# EasyEDA Pro project EasyEDAPro-Schematic.epro, schematic main, sheets 5 to 7 of 7

## Sheets
5 lcd-display-schematic: Create Date: 2024-01-21; Page Name: lcd-display-schematic; Update Date: 2024-01-23
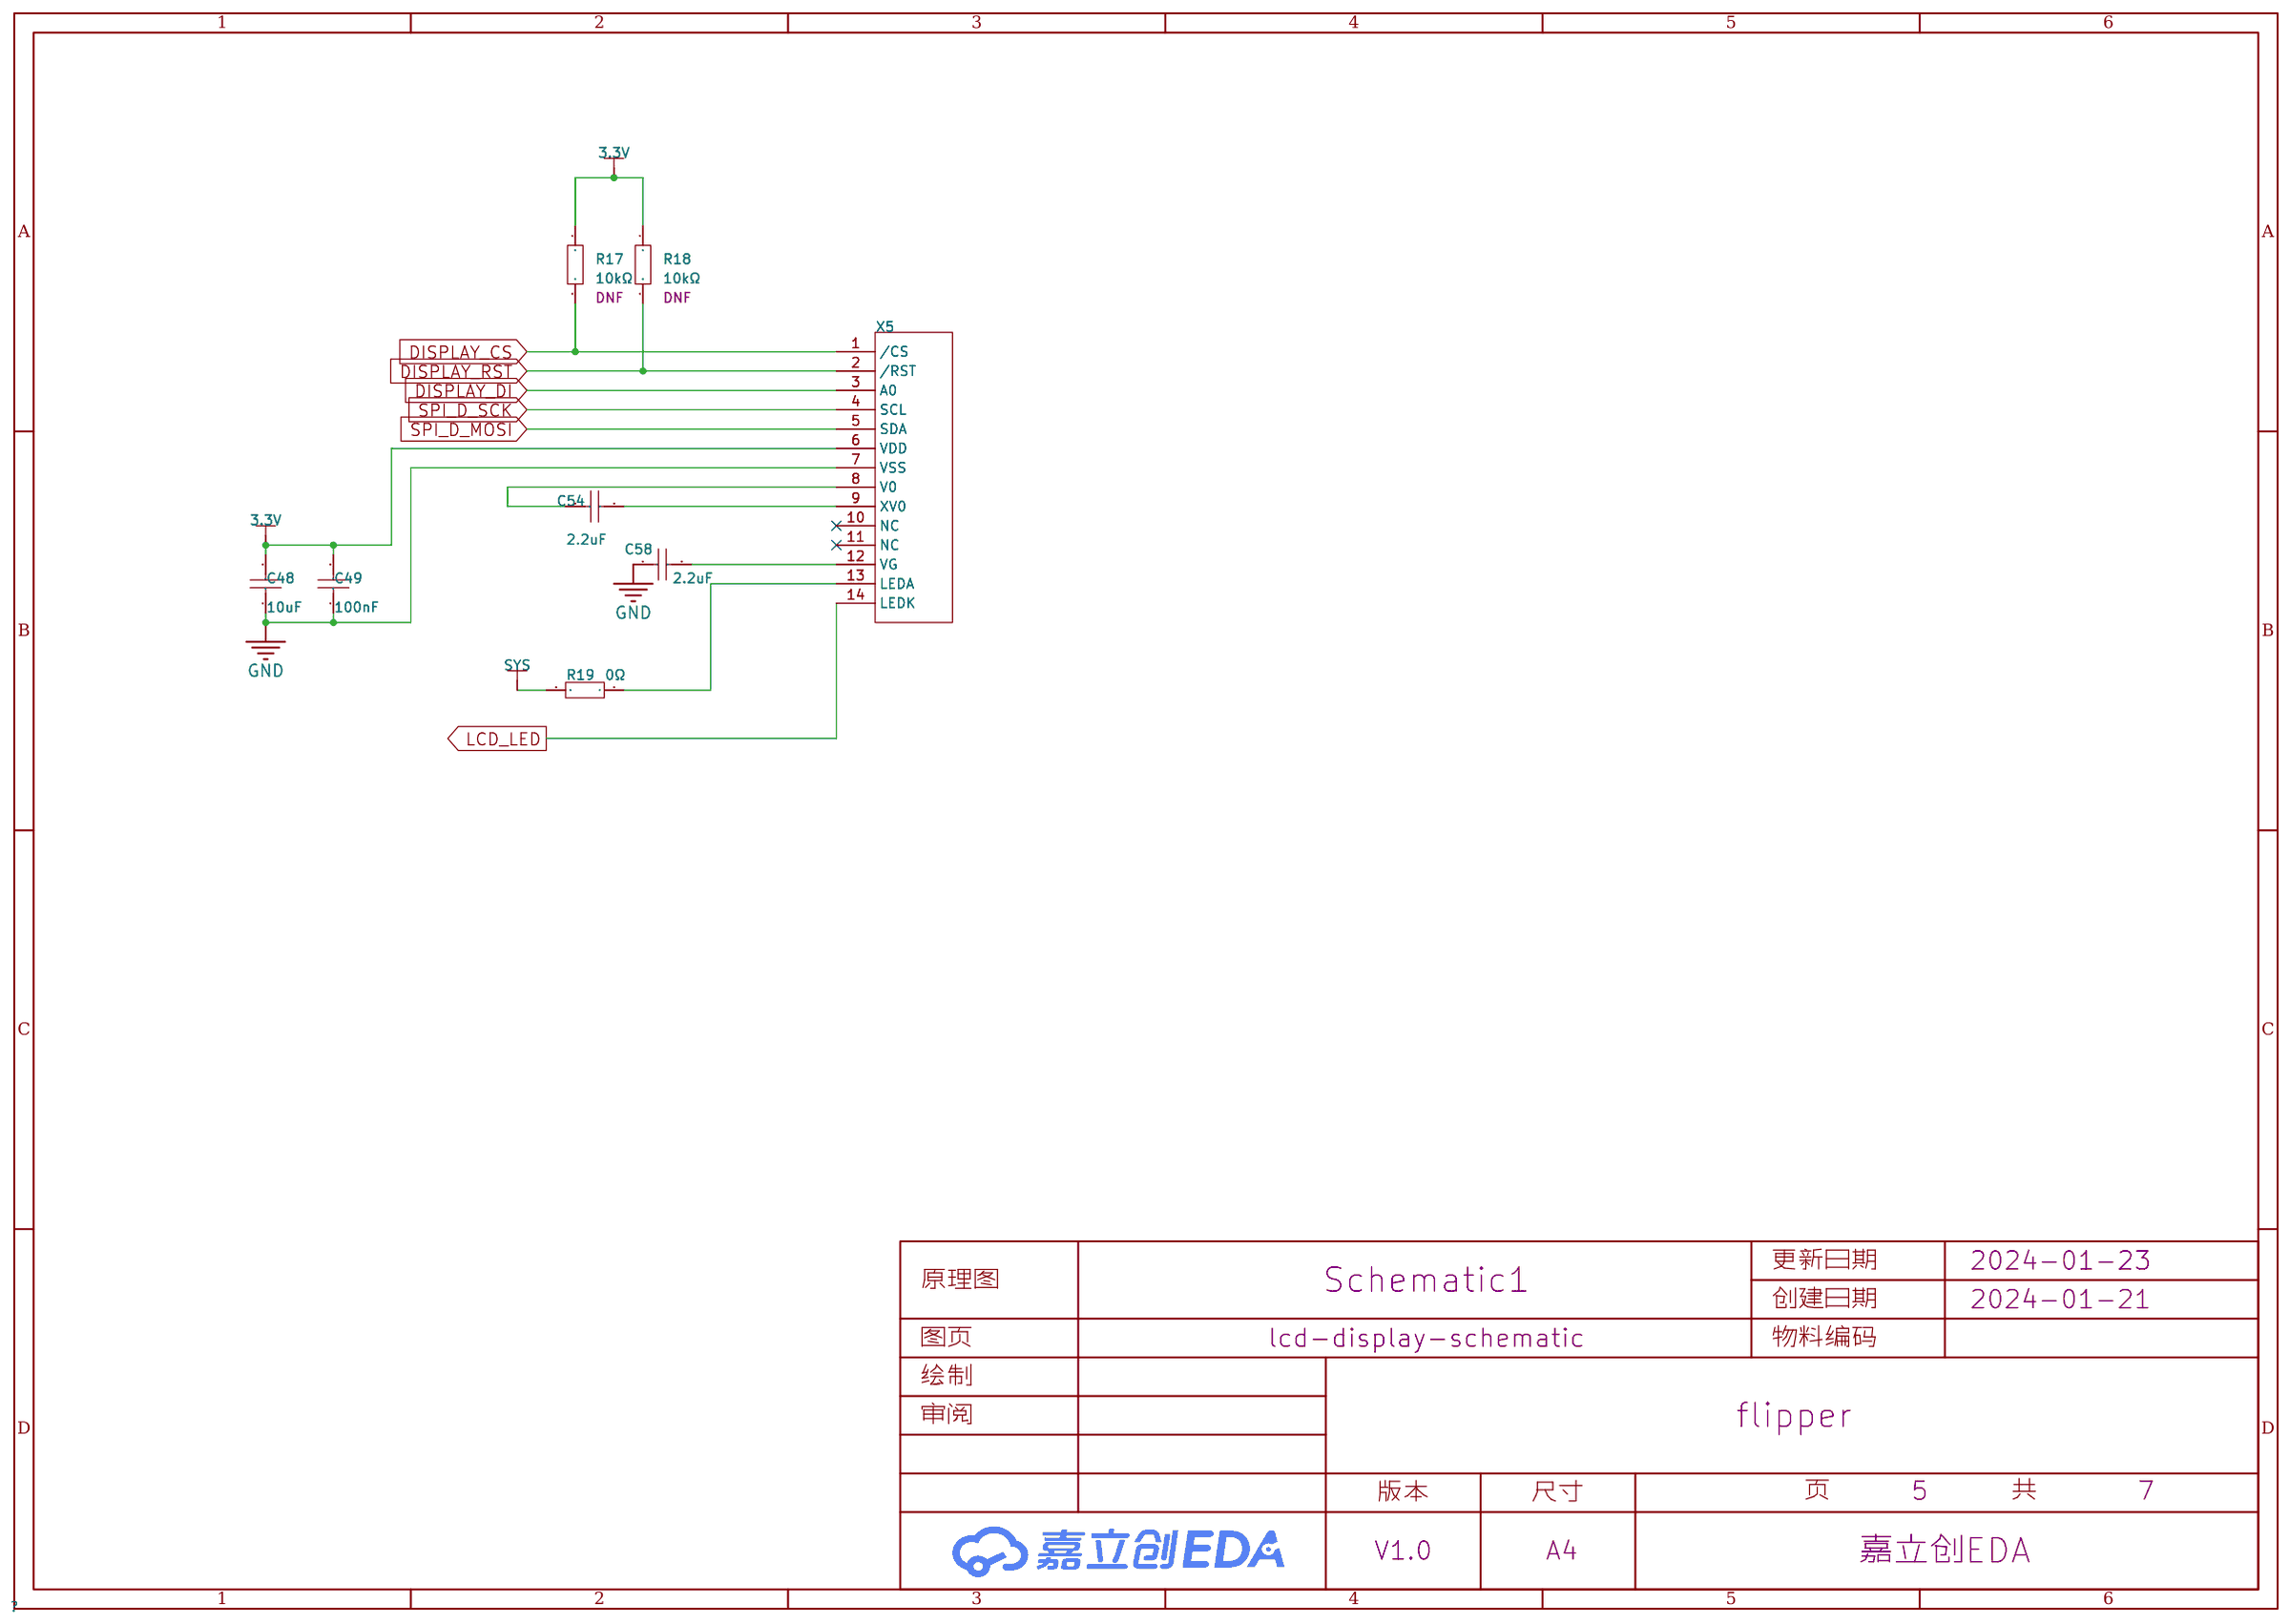
[diagram p4: lcd-display-schematic]
6 sub-1-ghz-cc1101: Create Date: 2024-01-21; Page Name: sub-1-ghz-cc1101.Schematic1; Update Date: 2024-01-23
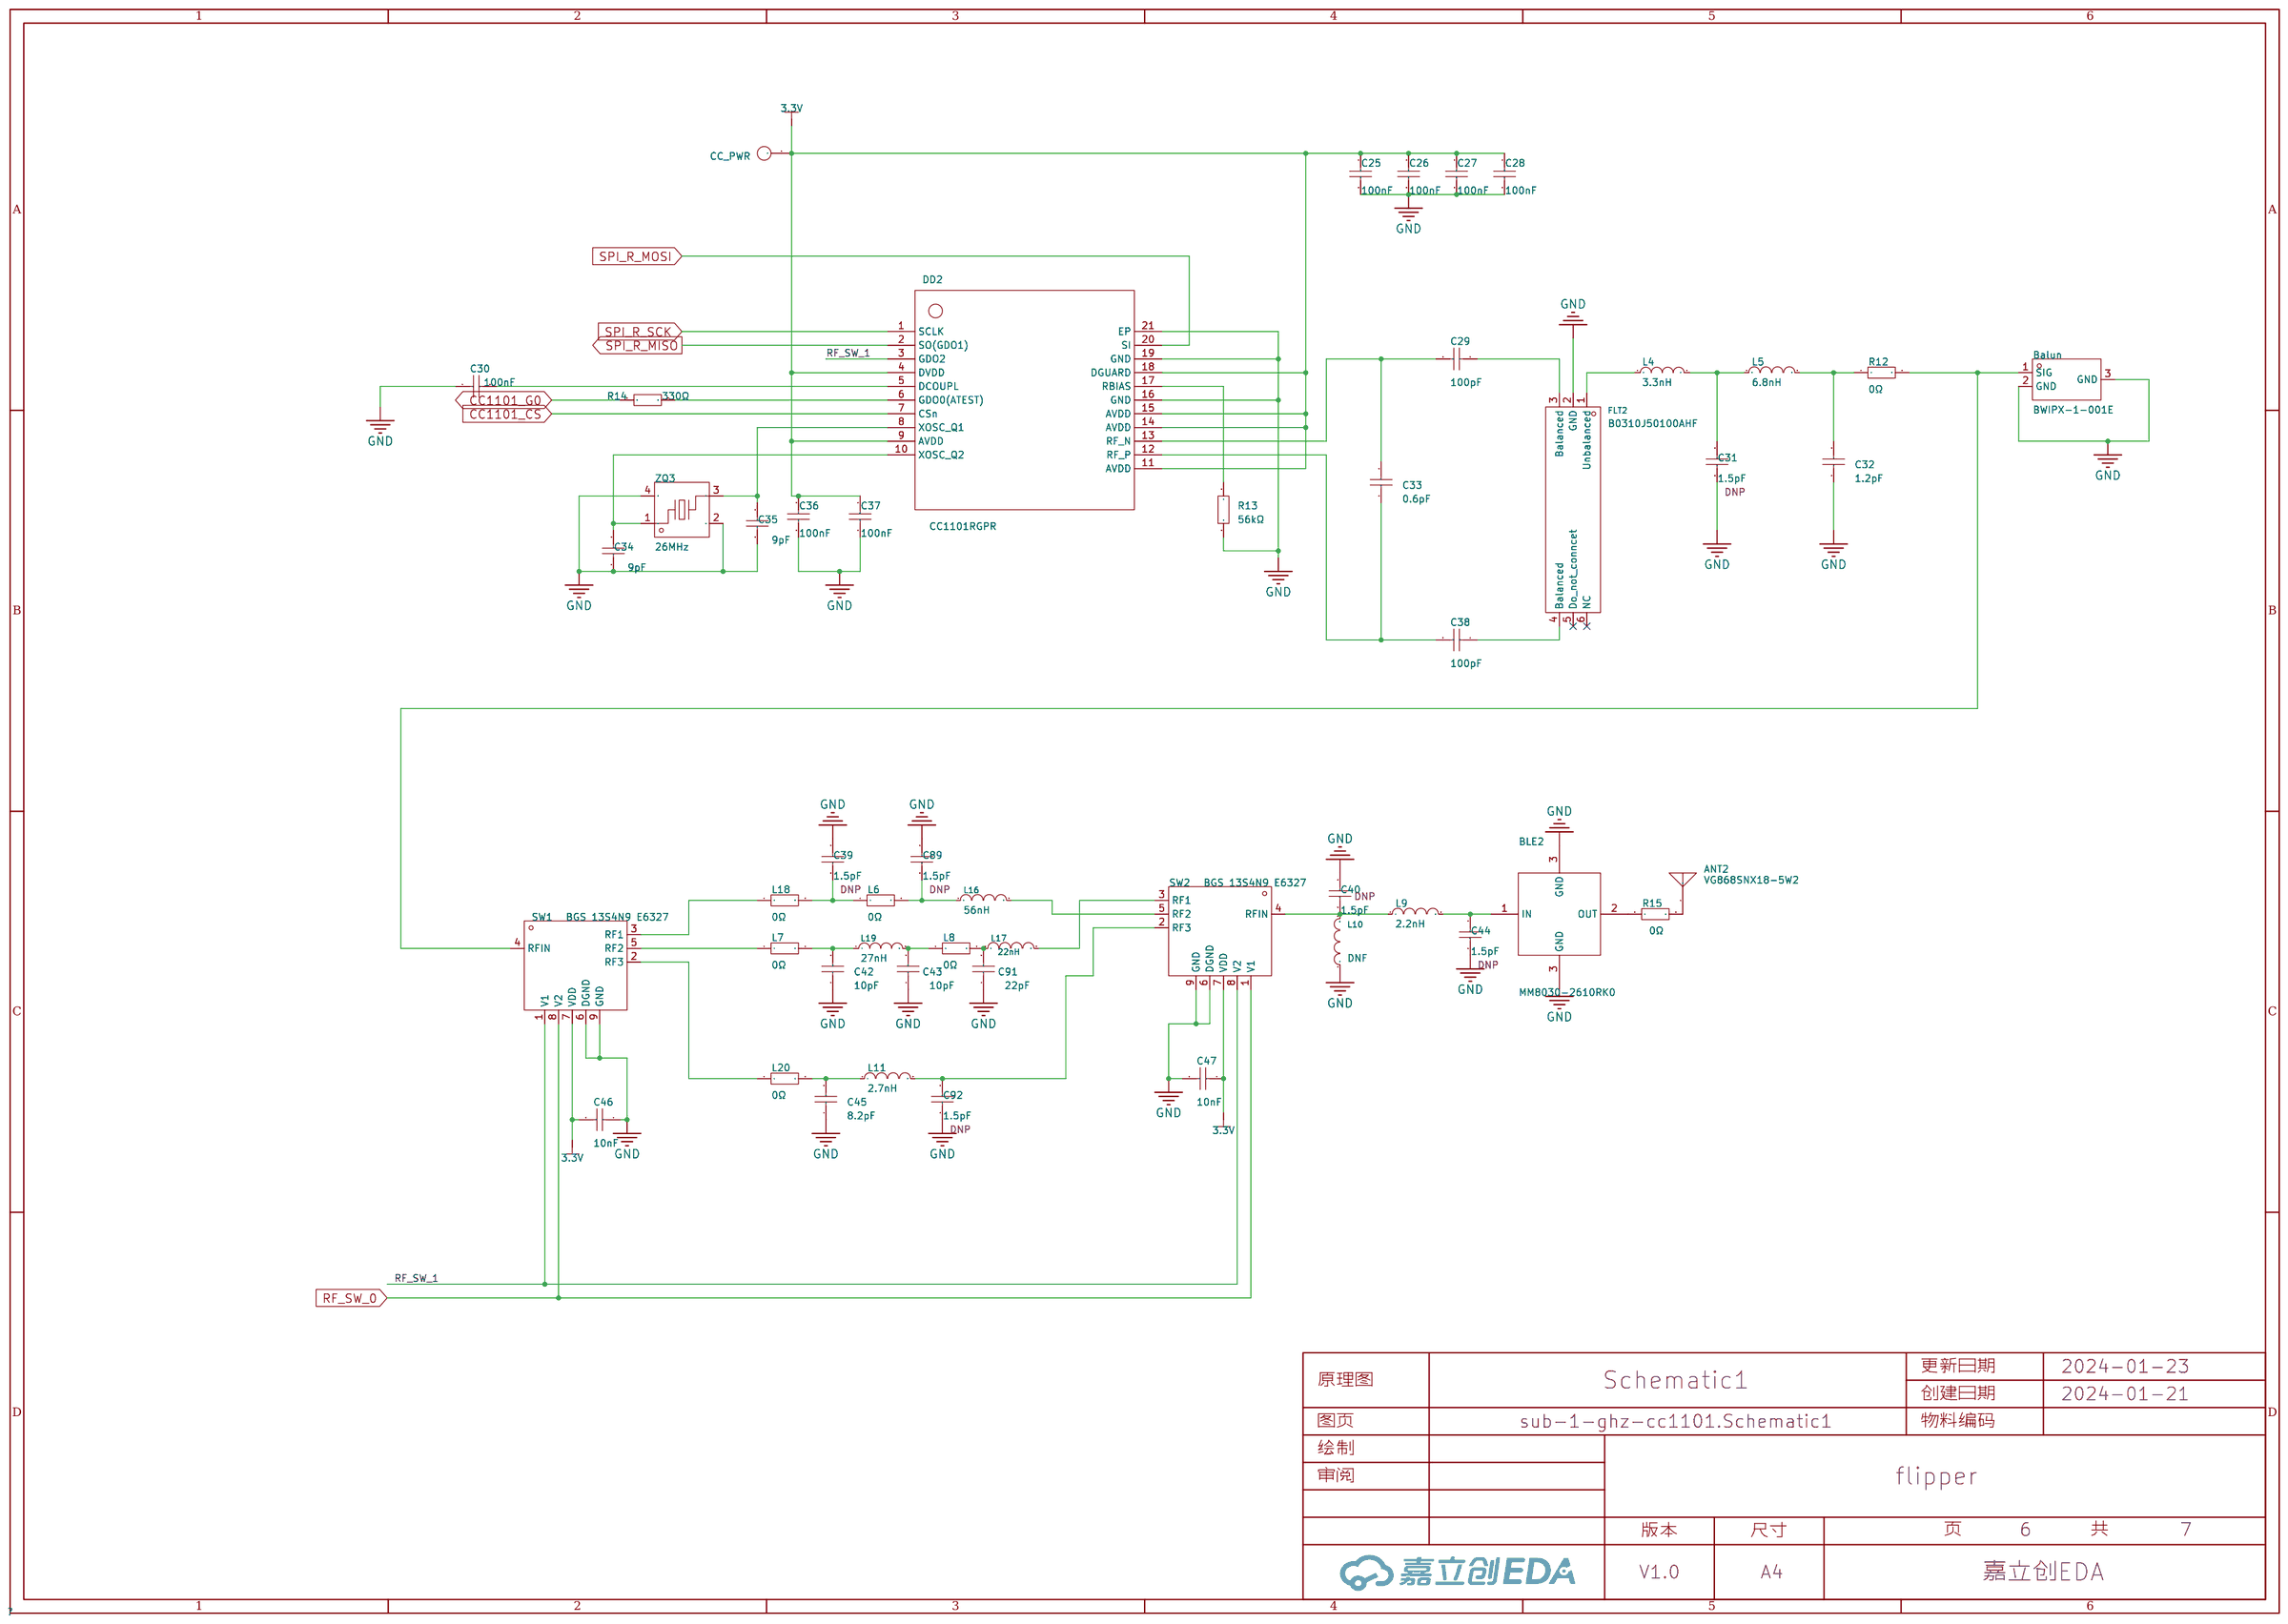
[diagram p5: sub-1-ghz-cc1101]
7 buttons: Create Date: 2024-01-21; Page Name: buttons; Update Date: 2024-01-23
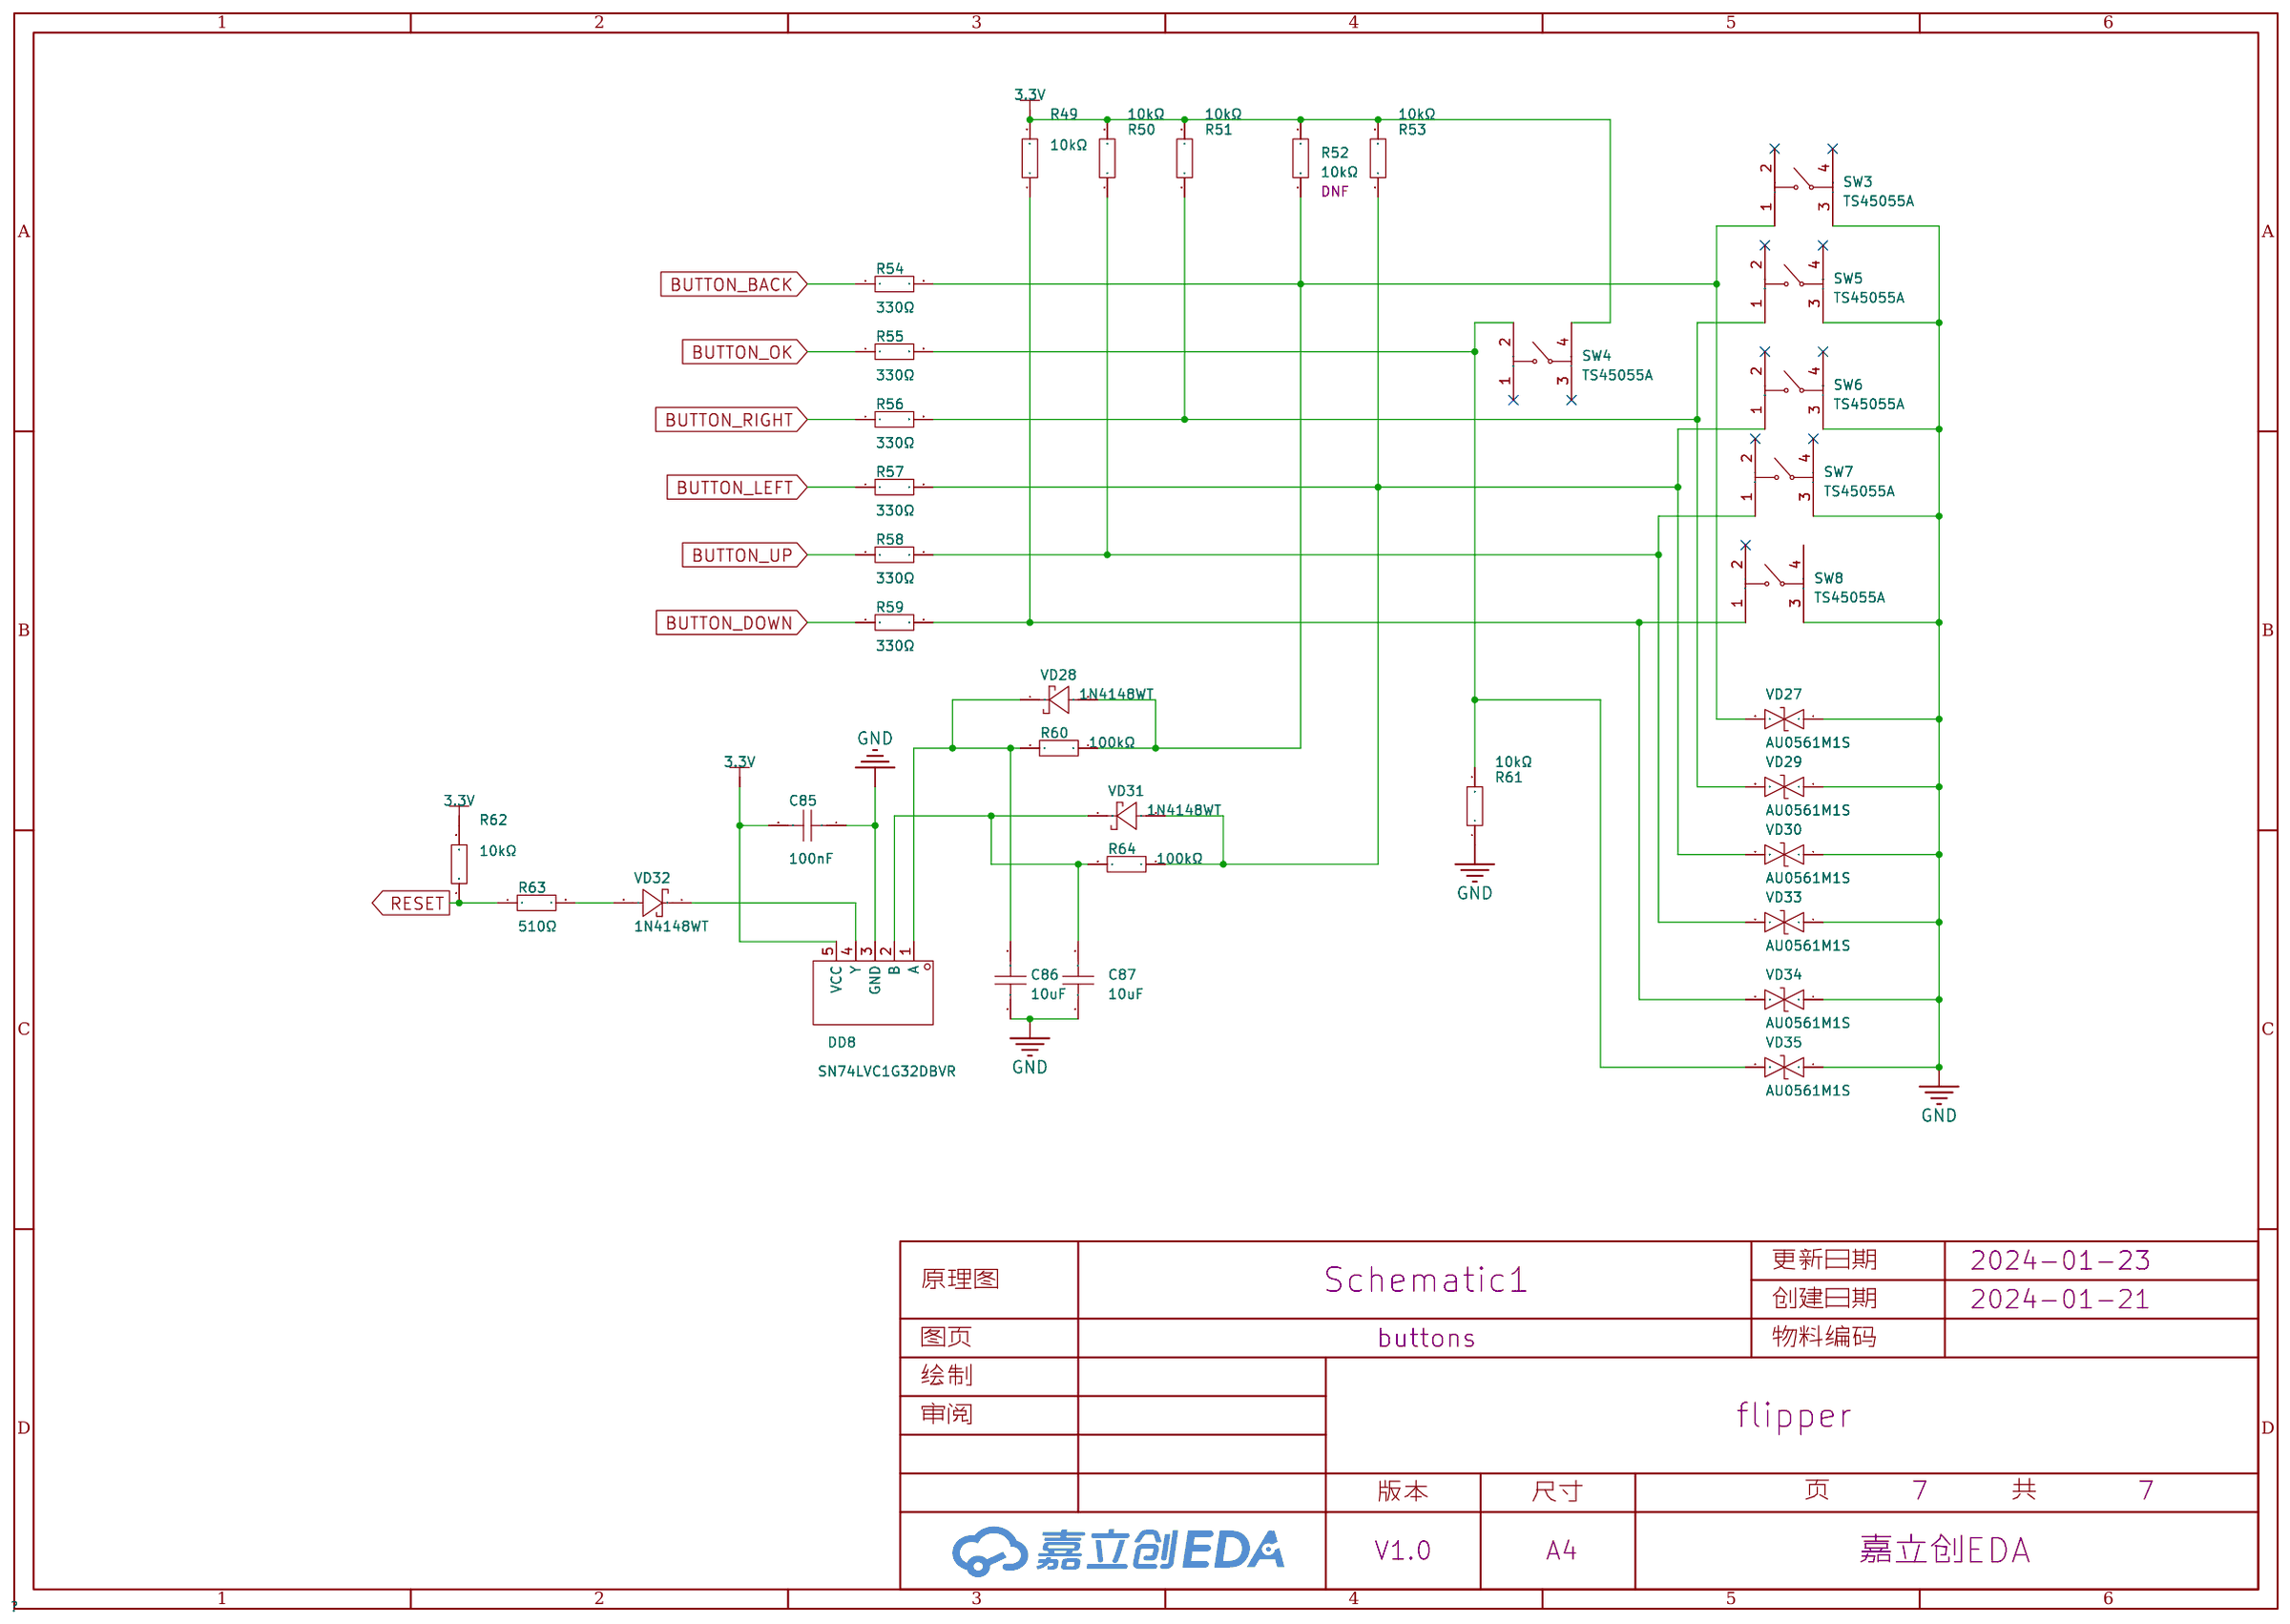
[diagram p6: buttons]

## Parts
sheet buttons
C85  100nF  [C0402]
C86  10uF  [C0603]
C87  10uF  [C0603]
DD8  SN74LVC1G32DBVR  [SOT-23-5_L3.0-W1.7-P0.95-LS2.8-BR]
R49  10kΩ  [R0402]
R50  10kΩ  [R0402]
R51  10kΩ  [R0402]
R52  10kΩ  [R0402]  (no BOM)
R53  10kΩ  [R0402]
R54  330Ω  [R0402]
R55  330Ω  [R0402]
R56  330Ω  [R0402]
R57  330Ω  [R0402]
R58  330Ω  [R0402]
R59  330Ω  [R0402]
R60  100kΩ  [R0402]
R61  10kΩ  [R0402]
R62  10kΩ  [R0402]
R63  510Ω  [R0402]
R64  100kΩ  [R0402]
SW3  TS45055A  [SW-SMD_4P-L4.5-W4.5-P3.50-LS5.0]
SW4  TS45055A  [SW-SMD_4P-L4.5-W4.5-P3.50-LS5.0]
SW5  TS45055A  [SW-SMD_4P-L4.5-W4.5-P3.50-LS5.0]
SW6  TS45055A  [SW-SMD_4P-L4.5-W4.5-P3.50-LS5.0]
SW7  TS45055A  [SW-SMD_4P-L4.5-W4.5-P3.50-LS5.0]
SW8  TS45055A  [SW-SMD_4P-L4.5-W4.5-P3.50-LS5.0]
VD27  AU0561M1S  [D0402-BI]
VD28  1N4148WT  [SOD-523_L1.2-W0.8-LS1.6-RD]
VD29  AU0561M1S  [D0402-BI]
VD30  AU0561M1S  [D0402-BI]
VD31  1N4148WT  [SOD-523_L1.2-W0.8-LS1.6-RD]
VD32  1N4148WT  [SOD-523_L1.2-W0.8-LS1.6-RD]
VD33  AU0561M1S  [D0402-BI]
VD34  AU0561M1S  [D0402-BI]
VD35  AU0561M1S  [D0402-BI]
sheet lcd-display-schematic
C48  10uF  [C0603]
C49  100nF  [C0402]
C54  2.2uF  [C0603]
C58  2.2uF  [C0603]
R17  10kΩ  [R0402]  (no BOM)
R18  10kΩ  [R0402]  (no BOM)
R19  0Ω  [R0402]
X5  -  [COG12864-12]
sheet sub-1-ghz-cc1101
ANT2  VG868SNX18-5W2  [ANT-TH_VG868SNX18-5W2]
Balun  BWIPX-1-001E  [IPEX-SMD_BWIPX-1-001E]  (no BOM)
BLE2  MM8030-2610RK0  [RF-SMD_MM8030-2610RK0]
C25  100nF  [C0402]
C26  100nF  [C0402]
C27  100nF  [C0402]
C28  100nF  [C0402]
C29  100pF  [C0402]
C30  100nF  [C0402]
C31  1.5pF  [C0402]  (no BOM)
C32  1.2pF  [C0402]
C33  0.6pF  [C0402]
C34  9pF  [C0402]
C35  9pF  [C0402]
C36  100nF  [C0402]
C37  100nF  [C0402]
C38  100pF  [C0402]
C39  1.5pF  [C0402]  (no BOM)
C40  1.5pF  [C0402]  (no BOM)
C42  10pF  [C0402]
C43  10pF  [C0402]
C44  1.5pF  [C0402]  (no BOM)
C45  8.2pF  [C0402]
C46  10nF  [C0402]
C47  10nF  [C0402]
C89  1.5pF  [C0402]  (no BOM)
C91  22pF  [C0402]
C92  1.5pF  [C0402]  (no BOM)
CC_PWR  -  [测试点0.8mm]
DD2  300 ~ 348 MHz, 387 ~ 464 MHz, 779 ~ 928 MHz  [QFN-20_L4.0-W4.0-P0.5-TL-EP]
FLT2  B0310J50100AHF  [XFMR-SMD_6P-L2.1-W1.3-P0.65-BL]
L4  3.3nH  [IND-SMD_L1.0-W0.5-2]
L5  6.8nH  [L0402]
L6  0Ω  [R0402]
L7  0Ω  [R0402]
L8  0Ω  [R0402]
L9  2.2nH  [IND-SMD_L1.0-W0.5-2]
L10  DNF  [L0402]  (no BOM)
L11  2.7nH  [L0402]
L16  56nH  [L0402]
L17  22nH  [L0402]
L18  0Ω  [R0402]
L19  27nH  [IND-SMD_L1.0-W0.6]
L20  0Ω  [R0402]
R12  0Ω  [R0402]
R13  56kΩ  [R0402]
R14  330Ω  [R0402]
R15  0Ω  [R0402]
SW1  BGS 13S4N9 E6327  [TSNP-9_L1.1-W1.1-P0.40-BL]
SW2  BGS 13S4N9 E6327  [TSNP-9_L1.1-W1.1-P0.40-BL]
ZQ3  26MHz  [CRYSTAL-SMD_4P-L2.0-W1.6-BL_HUAXIN_CN4]

## Library data of the parts
C25-C28 C30 C36 C37 C49 C85 = GRM155R71H104KE14D: 容值:100nF;精度:±10%;额定电压:50V;材质(温度系数):X7R;; LCSC Part Name: 100nF ±10% 50V; Supplier Part: C77020; Manufacturer: muRata(村田); Supplier Footprint: 0402; JLCPCB Part Class: Extended Part; Datasheet: https://atta.szlcsc.com/upload/public/pdf/source/20180326/C77020_39BD49C951FF1AF0DB1F1FAC5AC1E401.pdf; Supplier: LCSC; Tolerance: ±10%; Voltage Rated: 50V; Temperature Coefficient: X7R
C86 C87 = CL10A106MA8NRNC: 容值:10uF;精度:±20%;额定电压:25V;材质(温度系数):X5R;; LCSC Part Name: 10uF ±20% 25V; Supplier Part: C96446; Manufacturer: SAMSUNG(三星); Supplier Footprint: 0603; JLCPCB Part Class: 基础库; Datasheet: https://atta.szlcsc.com/upload/public/pdf/source/20160218/1457707763339.pdf; Supplier: LCSC; Tolerance: ±20%; Voltage Rated: 25V; Temperature Coefficient: X5R
DD8 = SN74LVC1G32DBVR: 逻辑类型:或门;通道数:1;电源电压:1.65V~5.5V;静态电流(最大值):10uA;最大传播延迟:4ns@5V,50pF;; Supplier Part: C10096; Manufacturer: TI(德州仪器); Supplier Footprint: SOT-23-5; JLCPCB Part Class: Extended Part; Datasheet: https://www.ti.com/cn/lit/gpn/sn74lvc1g32; Supplier: LCSC; Series: 74LVC; Logic Gate Type: 或门; Number of Channels: 1; Supply Voltage: 1.65V~5.5V; Quiescent Current (Max): 10uA; Sink Current: 32mA; Source Current: 32mA; High Level Range (VIH): 1.7V~2V; Low Level Range (VIL): 700mV~800mV; Propagation Delay Time: 4ns@5V,50pF; Operating Temperature: -40℃~+125℃
R49-R51 R53 R61 R62 = RC0402FR-0710KL: 电阻类型:厚膜电阻;阻值:10kΩ;精度:±1%;功率:62.5mW;; LCSC Part Name: 10kΩ ±1% 62.5mW; Supplier Part: C60490; Manufacturer: YAGEO(国巨); Supplier Footprint: 0402; JLCPCB Part Class: Extended Part; Datasheet: https://atta.szlcsc.com/upload/public/pdf/source/20170606/1496716515432.pdf; Supplier: LCSC; Type: 厚膜电阻; Tolerance: ±1%; Power(Watts): 62.5mW; Temperature Coefficient: ±100ppm/℃; Overload Voltage (Max): 50V; Operating Temperature Range: -55℃~+155℃
R17 R18 R52 = RC0402FR-0710KL: 电阻类型:厚膜电阻;阻值:10kΩ;精度:±1%;功率:62.5mW;; LCSC Part Name: 10kΩ ±1% 62.5mW; Supplier Part: C60490; Manufacturer: YAGEO(国巨); Supplier Footprint: 0402; JLCPCB Part Class: Extended Part; Datasheet: https://atta.szlcsc.com/upload/public/pdf/source/20170606/1496716515432.pdf; Supplier: LCSC; Type: 厚膜电阻; Tolerance: ±1%; Power(Watts): 62.5mW; Temperature Coefficient: ±100ppm/℃; Overload Voltage (Max): 50V; Operating Temperature Range: -55℃~+155℃; Comment: DNF
R14 R54-R59 = 0402WGF3300TCE: 阻值:330Ω;精度:±1%;功率:62.5mW;温度系数:±100ppm/℃;电阻类型:厚膜电阻;; LCSC Part Name: 330Ω ±1% 62.5mW 厚膜电阻; Supplier Part: C25104; Manufacturer: UNI-ROYAL(厚声); Supplier Footprint: 0402; JLCPCB Part Class: Basic Part; Datasheet: https://atta.szlcsc.com/upload/public/pdf/source/20200306/C422600_1E6D84923E4A46A82E41ADD87F860B5C.pdf; Supplier: LCSC; Tolerance: ±1%; Power(Watts): 62.5mW; Overload Voltage (Max): 50V; Temperature Coefficient: ±100ppm/℃; Type: 厚膜电阻; Operating Temperature Range: -55℃~+155℃
R60 R64 = RC0402FR-07100KL: 电阻类型:厚膜电阻;阻值:100kΩ;精度:±1%;功率:62.5mW;; LCSC Part Name: 100kΩ ±1% 62.5mW; Supplier Part: C60491; Manufacturer: YAGEO(国巨); Supplier Footprint: 0402; JLCPCB Part Class: Extended Part; Datasheet: https://atta.szlcsc.com/upload/public/pdf/source/20170518/1495086055123.pdf; Supplier: LCSC; Type: 厚膜电阻; Tolerance: ±1%; Power(Watts): 62.5mW; Temperature Coefficient: ±100ppm/℃; Overload Voltage (Max): 50V; Operating Temperature Range: -55℃~+155℃
R63 = 0402WGF5100TCE: 阻值:510Ω;精度:±1%;功率:62.5mW;温度系数:±100ppm/℃;电阻类型:厚膜电阻;; LCSC Part Name: 510Ω ±1% 62.5mW 厚膜电阻; Supplier Part: C25123; Manufacturer: UNI-ROYAL(厚声); Supplier Footprint: 0402; JLCPCB Part Class: Basic Part; Datasheet: https://atta.szlcsc.com/upload/public/pdf/source/20200306/C422600_1E6D84923E4A46A82E41ADD87F860B5C.pdf; Supplier: LCSC; Tolerance: ±1%; Power(Watts): 62.5mW; Overload Voltage (Max): 50V; Temperature Coefficient: ±100ppm/℃; Type: 厚膜电阻; Operating Temperature Range: -55℃~+155℃
SW3-SW8 = TS45055A: 电路结构:单刀单掷;按钮形状:圆形按钮;开关长度:4.5mm;开关宽度:4.5mm;开关高度:0.55mm;触点电流:50mA;额定电压(DC):12V;安装方式:立贴;带灯:-;作用力:250gf;机械寿命:-;; Supplier: LCSC; Supplier Part: C412371; Manufacturer: SHOU HAN(首韩); JLCPCB Part Class: 扩展库; LCSC Part Name: 4.5*4.5*0.55mm 立贴 轻触开关; Supplier Footprint: SMD; Datasheet: https://atta.szlcsc.com/upload/public/pdf/source/20190816/C412371_D8A54CDBD7F63FB011DAB95E3A8018F3.pdf; Circuit: 单刀单掷; Actuator Style: 圆形按钮; Switch Length: 4.5mm; Switch Width: 4.5mm; Switch Height: 0.55mm; Contact Current: 50mA; Voltage Rating (DC): 12V; Mounting Style: 立贴; Operating Force: 250gf
VD27 VD29 VD30 VD33-VD35 = AU0561M1S: 反向截止电压(Vrwm):5V@Max;最大钳位电压:10V;峰值脉冲电流(Ipp)@10/1000us:-;峰值脉冲功率(Ppp)@10/1000us:-;击穿电压:6V;; LCSC Part Name: 双向TVS 5V截止; Supplier Part: C3002761; Manufacturer: Applied Power(应能微); Supplier Footprint: 0402; JLCPCB Part Class: 扩展库; Datasheet: https://atta.szlcsc.com/upload/public/pdf/source/20220507/27E0F5E1FB204E6E73732074B4278B9F.pdf; Supplier: LCSC; Reverse Stand-Off Voltage (Vrwm): 5V@Max; Maximum Clamping Voltage: 10V; Breakdown Voltage: 6V; Reverse Leakage Current (Ir): 200nA; Type: TVS
VD28 VD31 VD32 = 1N4148WT_C727112: 二极管配置:独立式;正向压降(Vf):1.25V@150mA;直流反向耐压(Vr):75V;平均整流电流(Io):100mA;功率:150mW;反向恢复时间(trr):4ns;; LCSC Part Name: 电压:75V 电流:100mA; Supplier Part: C727112; Manufacturer: TWGMC(台湾迪嘉); Supplier Footprint: SOD-523; JLCPCB Part Class: 扩展库; Datasheet: https://atta.szlcsc.com/upload/public/pdf/source/20200828/C727112_FCA71CBB186A515518FBD85DA79D41CF.pdf; Supplier: LCSC; Diode Configuration: 独立式; Forward Voltage (Vf@If): 1.25V@150mA; Reverse Voltage (Vr): 75V; Average Rectified Current (Io): 100mA; Power Dissipation: 150mW; Reverse Leakage Current: 1uA@75V; Reverse Recovery Time (trr): 4ns; Operating Temperature: -65℃~+150℃@(Tj)
C48 = CL10A106MA8NRNC: 容值:10uF;精度:±20%;额定电压:25V;材质(温度系数):X5R;; LCSC Part Name: 10uF ±20% 25V; Supplier Part: C96446; Manufacturer: SAMSUNG(三星); Supplier Footprint: 0603; JLCPCB Part Class: Basic Part; Datasheet: https://atta.szlcsc.com/upload/public/pdf/source/20160218/1457707763339.pdf; Supplier: LCSC; Tolerance: ±20%; Voltage Rated: 25V; Temperature Coefficient: X5R
C54 C58 = CL10A225KA8NNNC: 容值:2.2uF;精度:±10%;额定电压:25V;材质(温度系数):X5R;; LCSC Part Name: 2.2uF ±10% 25V; Supplier Part: C57895; Manufacturer: SAMSUNG(三星); Supplier Footprint: 0603; JLCPCB Part Class: Extended Part; Datasheet: https://atta.szlcsc.com/upload/public/pdf/source/20160218/1457707763339.pdf; Supplier: LCSC; Tolerance: ±10%; Voltage Rated: 25V; Temperature Coefficient: X5R
R12 R19 = 0402WGF0000TCE: 阻值:0Ω;精度:±1%;功率:62.5mW;温度系数:±800ppm/℃;电阻类型:厚膜电阻;; LCSC Part Name: 0Ω ±1% 62.5mW 厚膜电阻; Supplier Part: C17168; Manufacturer: UNI-ROYAL(厚声); Supplier Footprint: 0402; JLCPCB Part Class: Basic Part; Datasheet: https://atta.szlcsc.com/upload/public/pdf/source/20200306/C422600_1E6D84923E4A46A82E41ADD87F860B5C.pdf; Supplier: LCSC; Tolerance: ±1%; Power(Watts): 62.5mW; Overload Voltage (Max): 50V; Temperature Coefficient: ±800ppm/℃; Type: 厚膜电阻; Operating Temperature Range: -55℃~+155℃
X5 = COG12864-12: Check: false
ANT2 = VG868SNX18-5W2: 868MHZ/2G/3G/GSM/GPRS/NB-IOT标准高增益纯铜天线; LCSC Part Name: 868MHZ天线高增益弹簧; Supplier Part: C718843; Manufacturer: Vollgo(沃进); JLCPCB Part Class: 扩展库; Datasheet: https://atta.szlcsc.com/upload/public/pdf/source/20200806/C718843_9FD966E7A87F359AA794720160AB31F3.pdf; Supplier: LCSC
Balun = BWIPX-1-001E: 连接器类型:板端;接口类型:内针;端口数量:1;接口直径:-;接口长度/高度:-;频率-最大值:6GHz;射频系列:IPEX;阻抗:50Ω;样式:-;工作温度范围:-;; LCSC Part Name: IPEX 内针; Supplier Part: C496552; Manufacturer: BAT WIRELESS(蝙蝠无线); Supplier Footprint: SMD; JLCPCB Part Class: Extended Part; Datasheet: https://atta.szlcsc.com/upload/public/pdf/source/20201223/C496552_05E5A9956EAE1A8819C5051D085B1DED.pdf; Supplier: LCSC; Connector Type: 板端; Interface Type: 内针; Number of Ports: 1; Frequency-Max: 6GHz; RF Series: IPEX; Impedance: 50Ω
BLE2 = MM8030-2610RK0: 连接器类型:板端;接口类型:内孔;端口数量:1;接口直径:1.35mm;接口长度/高度:0.45mm;频率-最大值:11GHz;射频系列:SWG;阻抗:50Ω;样式:-;工作温度范围:-;; LCSC Part Name: SWG 内孔; Supplier Part: C91632; Manufacturer: muRata(村田); Supplier Footprint: SMD; JLCPCB Part Class: Extended Part; Datasheet: https://atta.szlcsc.com/upload/public/pdf/source/20170103/1483439942333.pdf; Supplier: LCSC; Connector Type: 板端; Interface Type: 内孔; Number of Ports: 1; Interface Diameter: 1.35mm; Interface Length/Height: 0.45mm; Frequency-Max: 11GHz; RF Series: SWG; Impedance: 50Ω
C29 C38 = 0402CG101J500NT: 容值:100pF;精度:±5%;额定电压:50V;材质(温度系数):C0G;; LCSC Part Name: 100pF ±5% 50V; Supplier Part: C1546; Manufacturer: FH(风华); Supplier Footprint: 0402; JLCPCB Part Class: Basic Part; Datasheet: https://atta.szlcsc.com/upload/public/pdf/source/20200305/C486355_26A10D38EF8C2A5C37091D0039909270.pdf; Supplier: LCSC; Tolerance: ±5%; Voltage Rated: 50V; Temperature Coefficient: C0G
C31 C39 C40 C44 C89 C92 = CC0402BRNPO9BN1R5: 容值:1.5pF;额定电压:50V;材质(温度系数):NP0;; LCSC Part Name: 1.5pF 50V ±0.1pF; Supplier Part: C282238; Manufacturer: YAGEO(国巨); Supplier Footprint: 0402; JLCPCB Part Class: Extended Part; Datasheet: https://atta.szlcsc.com/upload/public/pdf/source/20181008/C309499_21CC21451B82C39E3D92150FD6B30293.pdf; Supplier: LCSC; Voltage Rated: 50V; Temperature Coefficient: NP0; Tolerance: ±10%; Comment: DNP
C32 = CC0402BRNPO9BN1R2: 容值:1.2pF;额定电压:50V;材质(温度系数):NP0;; LCSC Part Name: 1.2pF 50V ±0.1pF; Supplier Part: C327292; Manufacturer: YAGEO(国巨); Supplier Footprint: 0402; JLCPCB Part Class: Extended Part; Datasheet: https://atta.szlcsc.com/upload/public/pdf/source/20191125/C354976_4A9AE911FA5758D8C0A36AE6394FD4D7.pdf; Supplier: LCSC; Voltage Rated: 50V; Temperature Coefficient: NP0
C33 = GJM1555C1HR60WB01D: 容值:0.6pF;额定电压:50V;材质(温度系数):C0G;; LCSC Part Name: 0.6pF 50V ±0.05pF; Supplier Part: C88901; Manufacturer: muRata(村田); Supplier Footprint: 0402; JLCPCB Part Class: 扩展库; Datasheet: https://atta.szlcsc.com/upload/public/pdf/source/20190904/C426118_85E81C7C1F21FC87C5FB6D536E0847B4.pdf; Supplier: LCSC; Voltage Rated: 50V; Temperature Coefficient: C0G
C34 C35 = 0402CG9R0C500NT: 容值:9pF;额定电压:50V;材质(温度系数):C0G;; LCSC Part Name: 9pF 50V; Supplier Part: C1580; Manufacturer: FH(风华); Supplier Footprint: 0402; JLCPCB Part Class: Extended Part; Datasheet: https://atta.szlcsc.com/upload/public/pdf/source/20200305/C486355_26A10D38EF8C2A5C37091D0039909270.pdf; Supplier: LCSC; Voltage Rated: 50V; Temperature Coefficient: C0G; Tolerance: ±10%
C42 C43 = CL05C100JB5NNNC: 容值:10pF;精度:±5%;额定电压:50V;材质(温度系数):C0G;; LCSC Part Name: 10pF ±5% 50V; Supplier Part: C32949; Manufacturer: SAMSUNG(三星); Supplier Footprint: 0402; JLCPCB Part Class: Basic Part; Datasheet: https://atta.szlcsc.com/upload/public/pdf/source/20160218/1457707763339.pdf; Supplier: LCSC; Tolerance: ±5%; Voltage Rated: 50V; Temperature Coefficient: C0G
C45 = 0402CG8R2B500NT: 容值:8.2pF;额定电压:50V;材质(温度系数):C0G;; LCSC Part Name: 8.2pF 50V; Supplier Part: C501831; Manufacturer: FH(风华); Supplier Footprint: 0402; JLCPCB Part Class: Extended Part; Datasheet: https://atta.szlcsc.com/upload/public/pdf/source/20200305/C486355_26A10D38EF8C2A5C37091D0039909270.pdf; Supplier: LCSC; Voltage Rated: 50V; Temperature Coefficient: C0G
C46 C47 = CC0402KRX7R9BB103: 容值:10nF;精度:±10%;额定电压:50V;材质(温度系数):X7R;; LCSC Part Name: 10nF ±10% 50V; Supplier Part: C60133; Manufacturer: YAGEO(国巨); Supplier Footprint: 0402; JLCPCB Part Class: Extended Part; Datasheet: https://atta.szlcsc.com/upload/public/pdf/source/20180224/C181747_15194369449651363981.pdf; Supplier: LCSC; Tolerance: ±10%; Voltage Rated: 50V; Temperature Coefficient: X7R
C91 = GJM1555C1H220FB01D: 容值:22pF;精度:±1%;额定电压:50V;材质(温度系数):C0G;; LCSC Part Name: 22pF ±1% 50V; Supplier Part: C882567; Manufacturer: muRata(村田); Supplier Footprint: 0402; JLCPCB Part Class: Extended Part; Datasheet: https://atta.szlcsc.com/upload/public/pdf/source/20201204/C882567_3A662C0AB77FFF319E81D997EEF64A3D.pdf; Supplier: LCSC; Tolerance: ±1%; Voltage Rated: 50V; Temperature Coefficient: C0G
CC_PWR = 测试点: Check: false
DD2 = CC1101RGPR: 应用领域:通用ISM; Supplier: LCSC; Manufacturer: TI(德州仪器); Supplier Part: C29953; JLCPCB Part Class: 扩展库; LCSC Part Name: 低功率射频收发器 专为极低功耗无线应用设计; Supplier Footprint: QFN-20-EP(4x4); Datasheet: https://www.ti.com/cn/lit/gpn/cc1101; Applications: 通用ISM; Operating Voltage: 1.8V~3.6V; Frequency Range: 779MHz~928MHz；300MHz~348MHz; Typical Application Frequency: 433MHz；315MHz; Current Of Transmitting: 12.3mA; Receive Current: 14.3mA; Data Rate: 600Kbps; Sensitivity: -116dBm; Interface: SPI; Output Power: 12dBm; Operating Temperature: -40℃~+85℃
FLT2 = B0310J50100AHF: 频率范围:300MHz~1GHz;阻抗比-不平衡/平衡:50Ω:100Ω;回波损耗(最小值):8.1dB;插入损耗(最大值):1dB;相位差:38°;; Supplier Part: C502721; Manufacturer: Anaren(安伦); Supplier Footprint: 0805; JLCPCB Part Class: 扩展库; Datasheet: https://atta.szlcsc.com/upload/public/pdf/source/20200325/C502721_A0109360F8E5ACFD40E686632743EE17.pdf; Supplier: LCSC; Frequency Range: 300MHz~1GHz; Impedance Ratio-Unbalanced/Balanced: 50Ω:100Ω; Return Loss (Min): 8.1dB; Insertion Loss (Max): 1dB; Phase Balance: 38°
L4 = LQW15AN3N3C80D: 电感值:3.3nH;额定电流:2A;饱和电流(Isat):-;; Supplier Part: C237574; Manufacturer: muRata(村田); Supplier Footprint: 0402; JLCPCB Part Class: Extended Part; Datasheet: https://atta.szlcsc.com/upload/public/pdf/source/20200117/C71648_A73AE086BF8994AAD268F06999EA2D6E.pdf; Supplier: LCSC; Rated Current: 2A; DC Resistance (DCR): 30mΩ
L5 = LQW15AN6N8G00D: 电感值:6.8nH;精度:±2%;额定电流:700mA;饱和电流(Isat):-;; LCSC Part Name: 6.8nH ±2%; Supplier Part: C82919; Manufacturer: muRata(村田); Supplier Footprint: 0402; JLCPCB Part Class: 扩展库; Datasheet: https://atta.szlcsc.com/upload/public/pdf/source/20170325/1490427880931.pdf; Supplier: LCSC; Tolerance: ±2%; Rated Current: 700mA; DC Resistance (DCR): 90mΩ
L6-L8 L18 L20 R15 = 0402WGF0000TCE: 阻值:0Ω;精度:±1%;功率:62.5mW;温度系数:±800ppm/℃;电阻类型:厚膜电阻;; LCSC Part Name: 0Ω ±1% 62.5mW 厚膜电阻; Supplier Part: C17168; Manufacturer: UNI-ROYAL(厚声); Supplier Footprint: 0402; JLCPCB Part Class: 基础库; Datasheet: https://atta.szlcsc.com/upload/public/pdf/source/20200306/C422600_1E6D84923E4A46A82E41ADD87F860B5C.pdf; Supplier: LCSC; Tolerance: ±1%; Power(Watts): 62.5mW; Overload Voltage (Max): 50V; Temperature Coefficient: ±800ppm/℃; Type: 厚膜电阻; Operating Temperature Range: -55℃~+155℃
L9 = LQW15AN2N2G80D: 电感值:2.2nH;精度:±2%;额定电流:2.53A;饱和电流(Isat):-;; LCSC Part Name: 2.2nH ±2%; Supplier Part: C412264; Manufacturer: muRata(村田); Supplier Footprint: 0402; JLCPCB Part Class: Extended Part; Datasheet: https://atta.szlcsc.com/upload/public/pdf/source/20200107/C471381_7218EE88923040382E3940C2181C6210.pdf; Supplier: LCSC; Tolerance: ±2%; Rated Current: 2.53A; DC Resistance (DCR): 22mΩ
L10 L16 = LQW15AN56NG00D: 电感值:56nH;精度:±2%;额定电流:200mA;饱和电流(Isat):-;; LCSC Part Name: 56nH ±2%; Supplier Part: C167482; Manufacturer: muRata(村田); Supplier Footprint: 0402; JLCPCB Part Class: 扩展库; Datasheet: https://atta.szlcsc.com/upload/public/pdf/source/20191016/C437364_463D6516B3BAE72B1DA0754F3D9B8308.pdf; Supplier: LCSC; Tolerance: ±2%; Rated Current: 200mA; DC Resistance (DCR): 1.17Ω
L11 = LQG15HS2N7B02D: 电感值:2.7nH;精度:-;额定电流:800mA;直流电阻(DCR):120mΩ;饱和电流(Isat):-;; Supplier Part: C162541; Manufacturer: muRata(村田); Supplier Footprint: 0402; JLCPCB Part Class: 扩展库; Datasheet: https://atta.szlcsc.com/upload/public/pdf/source/20190301/C337910_27DA25781C95F885577870A93A746ADF.pdf; Supplier: LCSC; Rated Current: 800mA; DC Resistance (DCR): 120mΩ; Q @ Freq: 8@100MHz; Frequency - Self Resonant: 6GHz
L17 = LQW15AN22NG00D: Supplier Part: C86129; Manufacturer: muRata(村田); Supplier Footprint: 0402; JLCPCB Part Class: Extended Part; Datasheet: https://atta.szlcsc.com/upload/public/pdf/source/20180316/9F9AD211FF09D40AF5CB6AD447003171.pdf; Supplier: LCSC
L19 = LQW15AN27NG80D: 电感值:27nH;精度:±2%;额定电流:680mA;饱和电流(Isat):-;; LCSC Part Name: 27nH ±2%; Supplier Part: C882469; Manufacturer: muRata(村田); Supplier Footprint: 0402; JLCPCB Part Class: 扩展库; Datasheet: https://atta.szlcsc.com/upload/public/pdf/source/20201228/C882469_4C6BA0EE835EDA371FFF85E688E79DCC.pdf; Supplier: LCSC; Tolerance: ±2%; Rated Current: 680mA; DC Resistance (DCR): 288mΩ
R13 = 0402WGF5602TCE: 阻值:56kΩ;精度:±1%;功率:62.5mW;温度系数:±100ppm/℃;电阻类型:厚膜电阻;; LCSC Part Name: 56kΩ ±1% 62.5mW 厚膜电阻; Supplier Part: C25796; Manufacturer: UNI-ROYAL(厚声); Supplier Footprint: 0402; JLCPCB Part Class: Basic Part; Datasheet: https://atta.szlcsc.com/upload/public/pdf/source/20200306/C422600_1E6D84923E4A46A82E41ADD87F860B5C.pdf; Supplier: LCSC; Tolerance: ±1%; Power(Watts): 62.5mW; Overload Voltage (Max): 50V; Temperature Coefficient: ±100ppm/℃; Type: 厚膜电阻; Operating Temperature Range: -55℃~+155℃
SW1 SW2 = BGS 13S4N9 E6327: Supplier: LCSC; Supplier Part: C534205; Manufacturer: Infineon(英飞凌); JLCPCB Part Class: 扩展库; Supplier Footprint: DFN-9(1.1x1.1); Datasheet: https://atta.szlcsc.com/upload/public/pdf/source/20200515/C534205_970473F25FEF007D54205A1C0D69CBEF.pdf
ZQ3 = CN4026M00012001: 晶振类型:贴片晶振;频率:26MHz;常温频差:±10ppm;外接负载电容:12pF;频率稳定度(全温):±30ppm;; LCSC Part Name: 26MHz ±10ppm 12pF; Supplier Part: C7294686; Manufacturer: HUAXIN(华昕); Supplier Footprint: SMD2016-4P; Datasheet: https://atta.szlcsc.com/upload/public/pdf/source/20230621/D07BA817329CFFF46E0F5F6FD070A74C.pdf; Supplier: LCSC; Crystal Type: 贴片晶振; Normal temperature Frequency Tolerance: ±10ppm; External load capacitor: 12pF; Frequency Stability(Full temperature range): ±30ppm; Equivalent Series Resistance (ESR): 60Ω; Operating Temperature: -40℃~+85℃

## Nets
3.3V: C25.2 C26.2 C27.2 C28.2 C36.2 C37.2 C46.2 C47.1 C48.1 C49.1 C85.2 CC_PWR.1 DD2.4(DVDD) DD2.9(AVDD) DD2.11(AVDD) DD2.14(AVDD) DD2.15(AVDD) DD2.18(DGUARD) DD8.5(VCC) R17.1 R18.1 R49.2 R50.2 R51.2 R52.1 R53.2 R62.2 SW1.7(VDD) SW2.7(VDD) SW4.4 X5.6(VDD) ; also on sheet 2 3 4
GND: Balun.2(GND) Balun.3(GND) BLE2.3(GND) C25.1 C26.1 C27.1 C28.1 C30.1 C31.2 C32.1 C34.1 C35.1 C36.1 C37.1 C39.1 C40.1 C42.1 C43.1 C44.2 C45.1 C46.1 C47.2 C48.2 C49.2 C58.1 C85.1 C86.1 C87.1 C89.1 C91.1 C92.2 DD2.16(GND) DD2.19(GND) DD2.21(EP) DD8.3(GND) FLT2.2(GND) L10.1 R13.2 R61.1 SW1.6(DGND) SW1.9(GND) SW2.6(DGND) SW2.9(GND) SW3.3 SW5.3 SW6.3 SW7.3 SW8.3 VD27.1 VD29.1 VD30.1 VD33.1 VD34.1 VD35.1 X5.7(VSS) ZQ3.2(GND) ZQ3.4(GND) ; also on sheet 2 3 4
BUTTON_BACK: R54.1 ; also on sheet 2 4
BUTTON_DOWN: R59.1 ; also on sheet 4
BUTTON_LEFT: R57.1 ; also on sheet 4
BUTTON_OK: R55.1 ; also on sheet 4
BUTTON_RIGHT: R56.1 ; also on sheet 4
BUTTON_UP: R58.1 ; also on sheet 4
CC1101_CS: DD2.7(CSn) ; also on sheet 4
CC1101_G0: R14.2 ; also on sheet 4
DISPLAY_CS: R17.2 X5.1(/CS) ; also on sheet 4
DISPLAY_DI: X5.3(A0) ; also on sheet 4
DISPLAY_RST: R18.2 X5.2(/RST) ; also on sheet 4
LCD_LED: X5.14(LEDK) ; also on sheet 3
RESET: R62.1 R63.1 ; also on sheet 3 4
RF_SW_0: SW1.8(V2) SW2.1(V1) ; also on sheet 4
RF_SW_1: DD2.3(GDO2) SW1.1(V1) SW2.8(V2)
SPI_D_MOSI: X5.5(SDA) ; also on sheet 3 4
SPI_D_SCK: X5.4(SCL) ; also on sheet 3 4
SPI_R_MISO: DD2.2(SO(GDO1)) ; also on sheet 3 4
SPI_R_MOSI: DD2.20(SI) ; also on sheet 3 4
SPI_R_SCK: DD2.1(SCLK) ; also on sheet 3 4
SYS: R19.2 ; also on sheet 2 3
$5N2564: C58.2 X5.12(VG)
$5N2584: C54.2 X5.9(XV0)
$5N2587: C54.1 X5.8(V0)
$5N2686: R19.1 X5.13(LEDA)
$6N438: C30.2 DD2.5(DCOUPL)
$6N507: DD2.6(GDO0(ATEST)) R14.1
$6N812: C34.2 DD2.10(XOSC_Q2) ZQ3.1
$6N1033: DD2.17(RBIAS) R13.1
$6N1552: C29.2 C33.2 DD2.13(RF_N)
$6N1566: C33.1 C38.2 DD2.12(RF_P)
$6N1577: C38.1 FLT2.4(Balanced)
$6N1585: C29.1 FLT2.3(Balanced)
$6N1765: FLT2.1(Unbalanced) L4.1
$6N1905: C31.1 L4.2 L5.1
$6N2033: C32.2 L5.2 R12.1
$6N2116: Balun.1(SIG) R12.2 SW1.4(RFIN)
$6N3014: L18.1 SW1.3(RF1)
$6N3200: C39.2 L6.1 L18.2
$6N3281: C89.2 L6.2 L16.1
$6N3331: L7.1 SW1.5(RF2)
$6N3404: C42.2 L7.2 L19.1
$6N3553: C43.2 L8.1 L19.2
$6N3619: C91.2 L8.2 L17.1
$6N3704: L20.1 SW1.2(RF3)
$6N3898: C45.2 L11.1 L20.2
$6N4000: L16.2 SW2.5(RF2)
$6N4009: L17.2 SW2.3(RF1)
$6N4014: C92.1 L11.2 SW2.2(RF3)
$6N4148: C40.2 L9.1 L10.2 SW2.4(RFIN)
$6N4336: BLE2.1(IN) C44.1 L9.2
$6N12678: ANT2.1 R15.2
$6N12680: BLE2.2(OUT) R15.1
$6N17341: C35.2 DD2.8(XOSC_Q1) ZQ3.3
$7N1531: R51.1 R56.2 SW5.1 VD29.2
$7N1557: R50.1 R58.2 SW7.1 VD33.2
$7N1570: R49.1 R59.2 SW8.1 VD34.2
$7N1642: R55.2 R61.2 SW4.2 VD35.2
$7N1941: R52.2 R54.2 R60.1 SW3.1 VD27.2 VD28.2(A)
$7N2076: R53.1 R57.2 R64.1 SW6.1 VD30.2 VD31.2(A)
$7N2219: C86.2 DD8.1(A) R60.2 VD28.1(C)
$7N2237: C87.2 DD8.2(B) R64.2 VD31.1(C)
$7N2364: DD8.4(Y) VD32.1(C)
$7N2441: R63.2 VD32.2(A)

Not connected (* = marked no-connect by the designer): FLT2 5(Do not conncet)* 6(NC)*; SW3 2* 4*; SW4 1* 3*; SW5 2* 4*; SW6 2* 4*; SW7 2* 4*; SW8 2* 4; X5 10(NC)* 11(NC)*
